# Altium project 转接板v1.PrjPcb
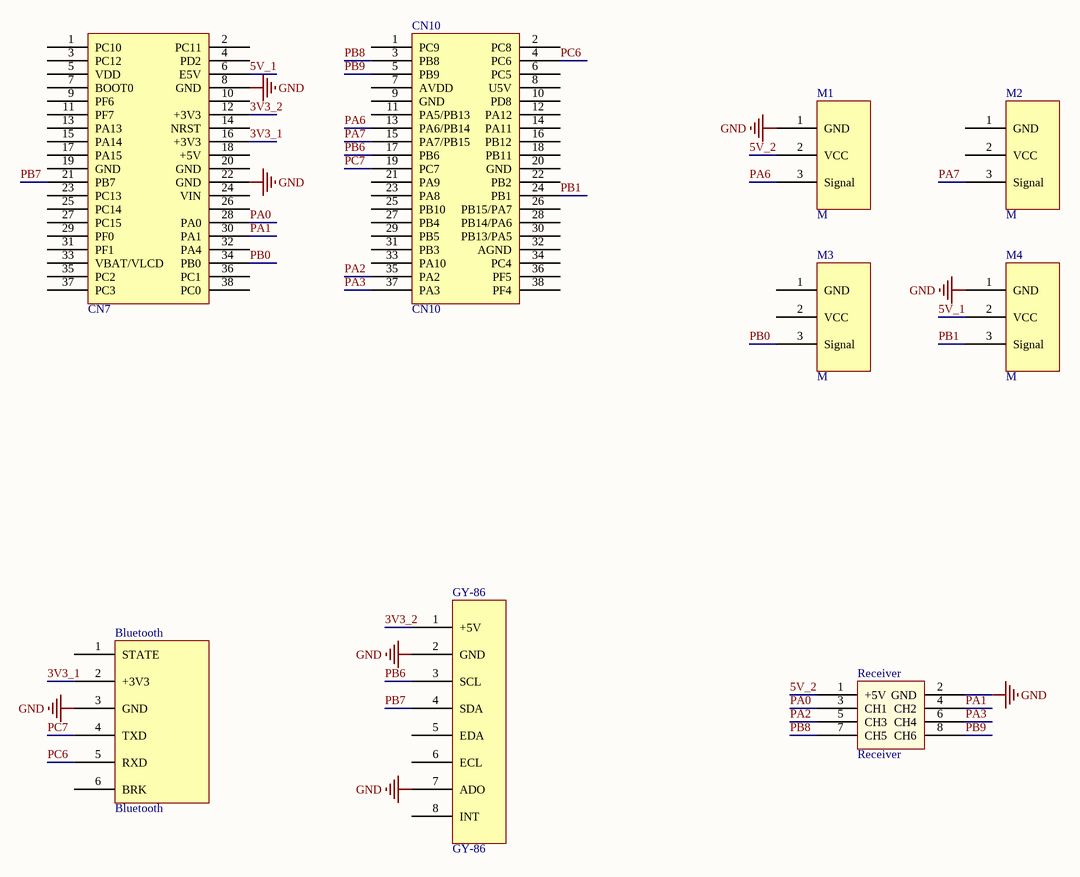
[diagram p0: 转接板v1.SchDoc]
1 sheet, 9 parts. Net scope: global (net labels, ports and power ports of the same name join across sheets).
Board file: 转接板v1.PcbDoc

## Sheet 转接板v1.SchDoc
size A4

### Parts
Bluetooth  Bluetooth  [Bluetooth]
CN7  CN7  [CN7]  (value not drawn)
CN10  CN10  [CN10]
GY-86  GY-86  [GY-86]
M1  M  [M]
M2  M  [M]
M3  M  [M]
M4  M  [M]
Receiver  Receiver  [Receiver]

### Nets
GND: Bluetooth.3(GND) CN7.8(GND) CN7.22(GND) GY-86.2(GND) GY-86.7(ADO) M1.1(GND) M4.1(GND) Receiver.2(GND)
3V3_1: Bluetooth.2(+3V3) CN7.16(+3V3)
3V3_2: CN7.12(+3V3) GY-86.1(+5V)
5V_1: CN7.6(E5V) M4.2(VCC)
5V_2: M1.2(VCC) Receiver.1(+5V)
PA0: CN7.28(PA0) Receiver.3(CH1)
PA1: CN7.30(PA1) Receiver.4(CH2)
PA2: CN10.35(PA2) Receiver.5(CH3)
PA3: CN10.37(PA3) Receiver.6(CH4)
PA6: CN10.13(PA6/PB14) M1.3(Signal)
PA7: CN10.15(PA7/PB15) M2.3(Signal)
PB0: CN7.34(PB0) M3.3(Signal)
PB1: CN10.24(PB1) M4.3(Signal)
PB6: CN10.17(PB6) GY-86.3(SCL)
PB7: CN7.21(PB7) GY-86.4(SDA)
PB8: CN10.3(PB8) Receiver.7(CH5)
PB9: CN10.5(PB9) Receiver.8(CH6)
PC6: Bluetooth.5(RXD) CN10.4(PC6)
PC7: Bluetooth.4(TXD) CN10.19(PC7)

Not connected (* = marked no-connect by the designer): Bluetooth 1(STATE) 6(BRK); CN7 1(PC10) 2(PC11) 3(PC12) 4(PD2) 5(VDD) 7(BOOT0) 9(PF6) 10 11(PF7) 13(PA13) 14(NRST) 15(PA14) 17(PA15) 18(+5V) 19(GND) 20(GND) 23(PC13) 24(VIN) 25(PC14) 26 27(PC15) 29(PF0) 31(PF1) 32(PA4) 33(VBAT/VLCD) 35(PC2) 36(PC1) 37(PC3) 38(PC0); CN10 1(PC9) 2(PC8) 6(PC5) 7(AVDD) 8(U5V) 9(GND) 10(PD8) 11(PA5/PB13) 12(PA12) 14(PA11) 16(PB12) 18(PB11) 20(GND) 21(PA9) 22(PB2) 23(PA8) 25(PB10) 26(PB15/PA7) 27(PB4) 28(PB14/PA6) 29(PB5) 30(PB13/PA5) 31(PB3) 32(AGND) 33(PA10) 34(PC4) 36(PF5) 38(PF4); GY-86 5(EDA) 6(ECL) 8(INT); M2 1(GND) 2(VCC); M3 1(GND) 2(VCC)